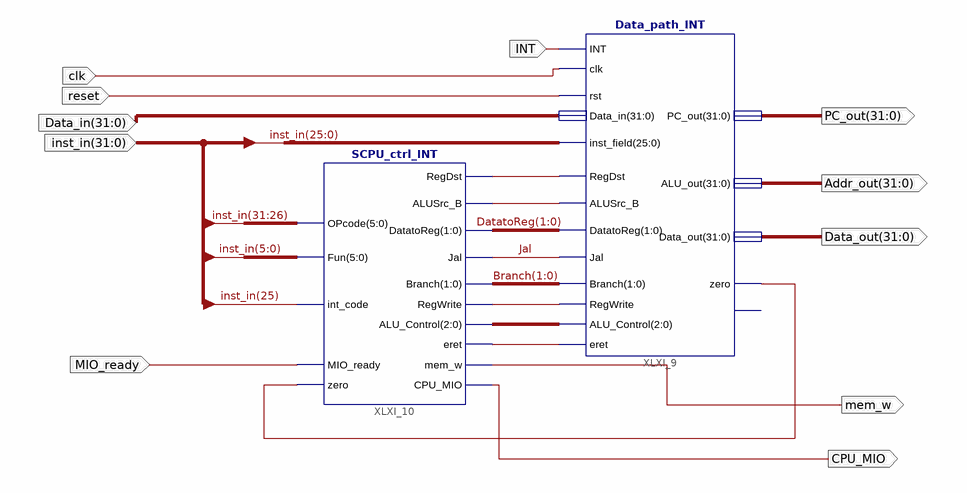
[diagram p0: schematic sheet 1]
// Xilinx ISE schematic SCPU_INT.sch (kintex7) as structural Verilog: 2 symbols, 11 ports
module SCPU_INT (
  input  [31:0] inst_in,
  input  clk,
  input  reset,
  input  [31:0] Data_in,
  input  MIO_ready,
  input  INT,
  output [31:0] PC_out,
  output [31:0] Addr_out,
  output [31:0] Data_out,
  output mem_w,
  output CPU_MIO
);

  wire Jal, XLXN_2, XLXN_7, XLXN_8, XLXN_9, XLXN_12;
  wire [1:0] Branch, DatatoReg;
  wire [2:0] XLXN_1;

  Data_path_INT XLXI_9 (
    .RegDst(XLXN_8), .ALUSrc_B(XLXN_7), .DatatoReg(DatatoReg), .Jal(Jal), .Branch(Branch), .Data_in(Data_in),
    .inst_field(inst_in[25:0]), .clk(clk), .rst(reset), .PC_out(PC_out), .ALU_out(Addr_out),
    .Data_out(Data_out), .zero(XLXN_9), .RegWrite(XLXN_2), .ALU_Control(XLXN_1), .eret(XLXN_12), .INT(INT));  // open: overflow
  SCPU_ctrl_INT XLXI_10 (
    .RegDst(XLXN_8), .ALUSrc_B(XLXN_7), .DatatoReg(DatatoReg), .Jal(Jal), .Fun(inst_in[5:0]),
    .OPcode(inst_in[31:26]), .MIO_ready(MIO_ready), .zero(XLXN_9), .CPU_MIO(CPU_MIO), .mem_w(mem_w),
    .Branch(Branch), .RegWrite(XLXN_2), .eret(XLXN_12), .ALU_Control(XLXN_1), .int_code(inst_in[25]));
endmodule
